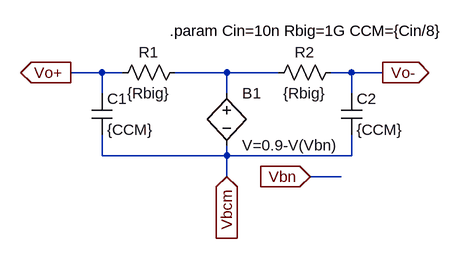
[diagram p0: schematic CMFB.asc]
CMFB.asc, the LTspice schematic file:
Version 4
SHEET 1 880 680
WIRE -32 192 -80 192
WIRE 0 192 -32 192
WIRE 160 192 80 192
WIRE 240 192 160 192
WIRE 352 192 320 192
WIRE 400 192 352 192
WIRE -32 224 -32 192
WIRE 160 224 160 192
WIRE 352 224 352 192
WIRE -32 320 -32 288
WIRE 160 320 160 304
WIRE 160 320 -32 320
WIRE 352 320 352 288
WIRE 352 320 160 320
WIRE 160 352 160 320
WIRE 336 352 288 352
FLAG -80 192 Vo+
IOPIN -80 192 Out
FLAG 160 352 Vbcm
IOPIN 160 352 In
FLAG 288 352 Vbn
IOPIN 288 352 In
FLAG 400 192 Vo-
IOPIN 400 192 Out
DATAFLAG 160 192 "round($*1000)/1000"
DATAFLAG -32 192 "round($*1000)/1000"
DATAFLAG 352 192 "round($*1000)/1000"
DATAFLAG 80 320 "round($*1000)/1000"
DATAFLAG 336 352 "round($*1000)/1000"
SYMBOL res 96 176 R90
WINDOW 0 0 56 VBottom 2
WINDOW 3 32 56 VTop 2
SYMATTR InstName R1
SYMATTR Value {Rbig}
SYMBOL cap -48 224 R0
SYMATTR InstName C1
SYMATTR Value {CCM}
SYMBOL bv 160 208 R0
SYMATTR InstName B1
SYMATTR Value V=0.9-V(Vbn)
SYMBOL res 336 176 R90
WINDOW 0 0 56 VBottom 2
WINDOW 3 32 56 VTop 2
SYMATTR InstName R2
SYMATTR Value {Rbig}
SYMBOL cap 336 224 R0
SYMATTR InstName C2
SYMATTR Value {CCM}
TEXT 72 128 Left 2 !.param Cin=10n Rbig=1G CCM={Cin/8}

The netlist it stands for:
* CMFB.asc
R1 N001 Vo+ {Rbig}
C1 Vo+ Vbcm {CCM}
B1 N001 Vbcm V=0.9-V(Vbn)
R2 Vo- N001 {Rbig}
C2 Vo- Vbcm {CCM}
.param Cin=10n Rbig=1G CCM={Cin/8}
.backanno
.end